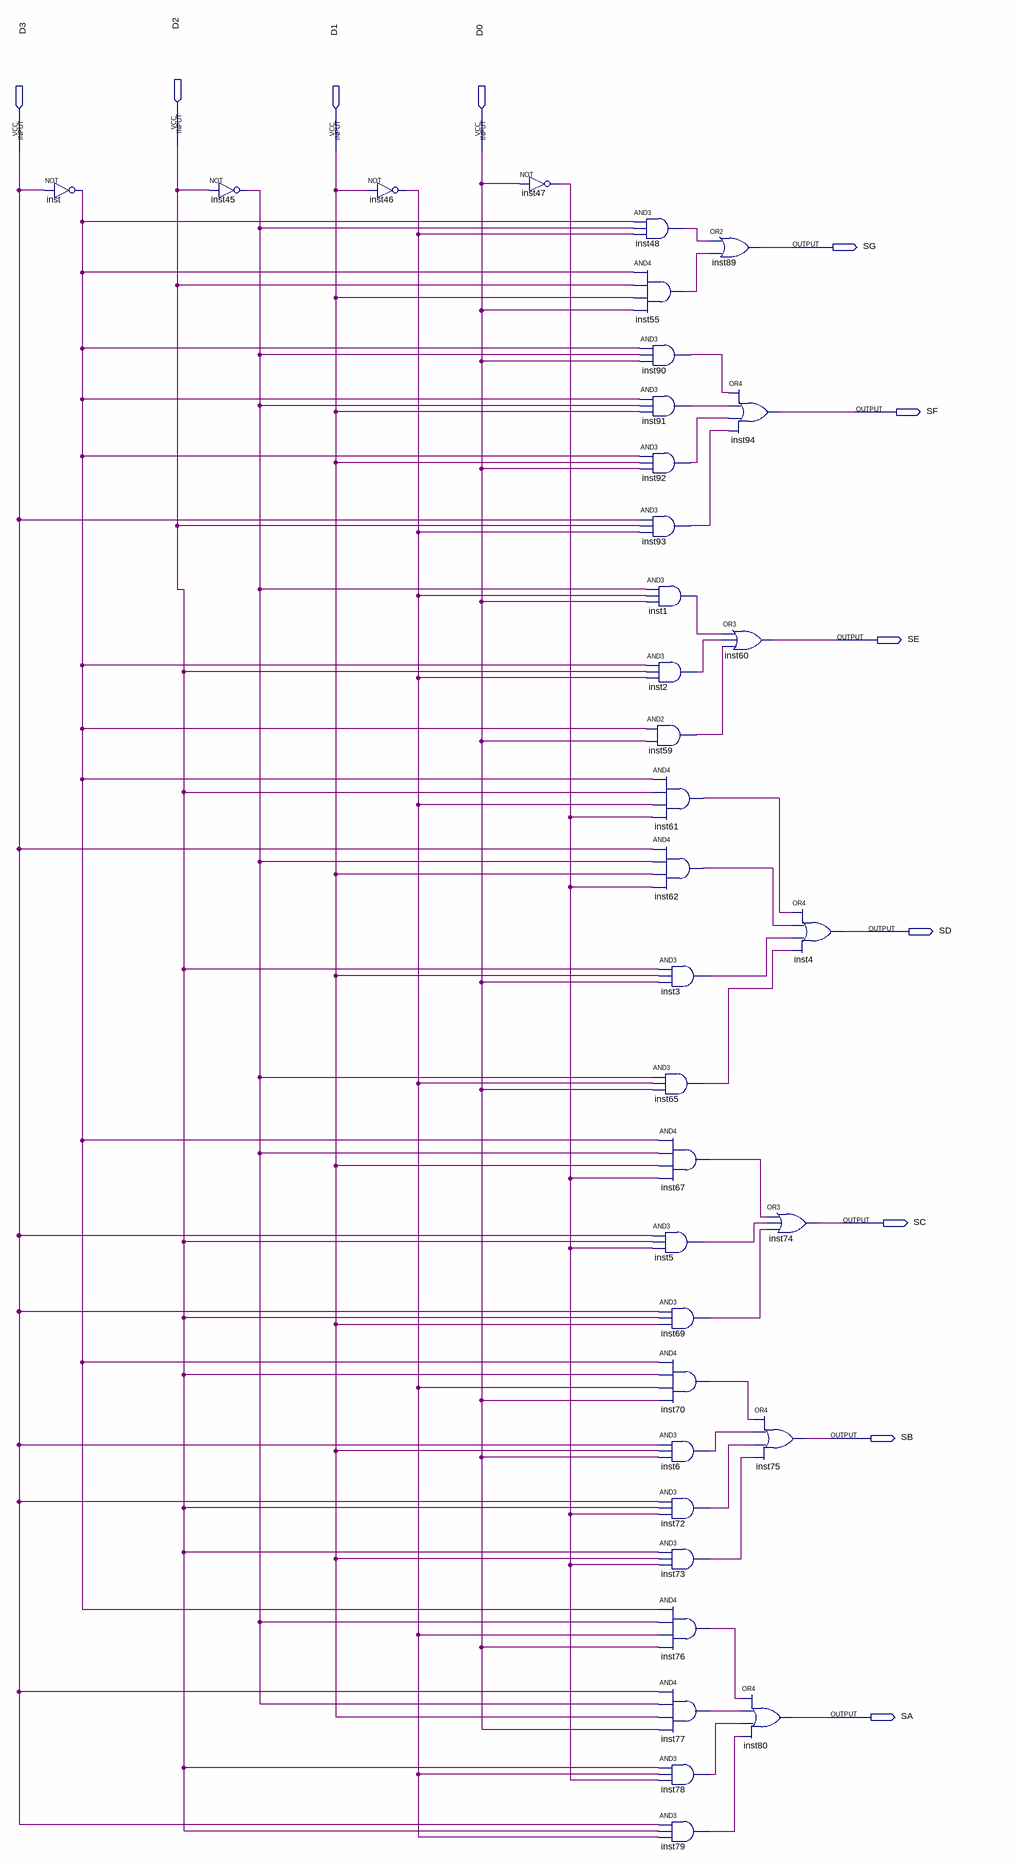
[diagram p0: schematic sheet]
// Quartus schematic lab03_nnm.bdf as structural Verilog: 35 symbols, 11 pins
module lab03_nnm (
  input  D2,
  input  D3,
  input  D1,
  input  D0,
  output SG,
  output SF,
  output SE,
  output SD,
  output SC,
  output SB,
  output SA
);

  wire inst1_out, inst2_out, inst3_out, inst5_out, inst6_out, inst45_out, inst46_out, inst47_out, inst48_out,
       inst55_out, inst59_out, inst61_out, inst62_out, inst65_out, inst67_out, inst69_out, inst70_out,
       inst72_out, inst73_out, inst76_out, inst77_out, inst78_out, inst79_out, inst90_out, inst91_out,
       inst92_out, inst93_out, inst_out;

  not inst (inst_out, D3);
  not inst45 (inst45_out, D2);
  not inst46 (inst46_out, D1);
  not inst47 (inst47_out, D0);
  and inst48 (inst48_out, inst_out, inst45_out, inst46_out);
  and inst55 (inst55_out, inst_out, D2, D1, D0);
  and inst90 (inst90_out, inst_out, inst45_out, D0);
  and inst91 (inst91_out, inst_out, inst45_out, D1);
  and inst92 (inst92_out, inst_out, D1, D0);
  and inst93 (inst93_out, D3, D2, inst46_out);
  and inst1 (inst1_out, inst45_out, inst46_out, D0);
  and inst2 (inst2_out, inst_out, D2, inst46_out);
  and inst59 (inst59_out, inst_out, D0);
  and inst61 (inst61_out, inst_out, D2, inst46_out, inst47_out);
  and inst62 (inst62_out, D3, inst45_out, D1, inst47_out);
  and inst3 (inst3_out, D2, D1, D0);
  and inst65 (inst65_out, inst45_out, inst46_out, D0);
  and inst67 (inst67_out, inst_out, inst45_out, D1, inst47_out);
  and inst5 (inst5_out, D3, D2, inst47_out);
  and inst69 (inst69_out, D3, D2, D1);
  and inst70 (inst70_out, inst_out, D2, inst46_out, D0);
  and inst6 (inst6_out, D3, D1, D0);
  and inst72 (inst72_out, D3, D2, inst47_out);
  and inst73 (inst73_out, D2, D1, inst47_out);
  and inst76 (inst76_out, inst_out, inst45_out, inst46_out, D0);
  and inst77 (inst77_out, D3, inst45_out, D1, D0);
  and inst78 (inst78_out, D2, inst46_out, inst47_out);
  and inst79 (inst79_out, D3, D2, inst46_out);
  or inst89 (SG, inst48_out, inst55_out);
  or inst94 (SF, inst90_out, inst91_out, inst92_out, inst93_out);
  or inst60 (SE, inst1_out, inst2_out, inst59_out);
  or inst74 (SC, inst67_out, inst5_out, inst69_out);
  or inst75 (SB, inst70_out, inst6_out, inst72_out, inst73_out);
  or inst80 (SA, inst76_out, inst77_out, inst78_out, inst79_out);
  or inst4 (SD, inst61_out, inst62_out, inst3_out, inst65_out);
endmodule
